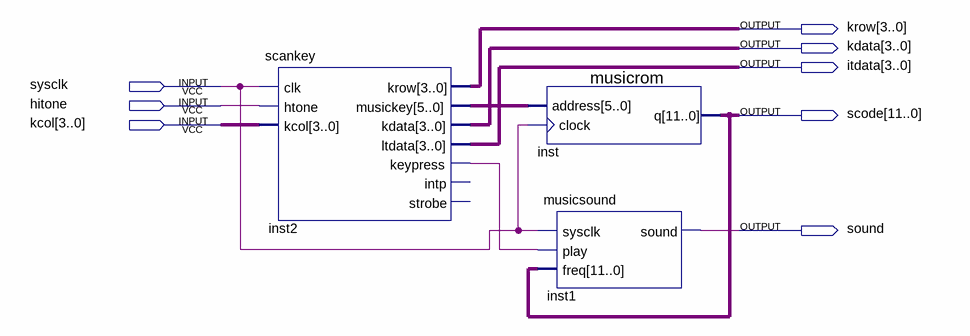
[diagram p0: schematic sheet]
// Quartus schematic muscikey.bdf as structural Verilog: 3 symbols, 8 pins
module muscikey (
  input  sysclk,
  input  hitone,
  input  [3:0] kcol,
  output [3:0] krow,
  output [3:0] kdata,
  output [3:0] itdata,
  output [11:0] scode,
  output sound
);

  wire inst2_keypress;
  wire [5:0] inst2_musickey;

  scankey inst2 (
    .clk(sysclk), .htone(hitone), .kcol(kcol), .krow(krow), .musickey(inst2_musickey), .kdata(kdata),
    .ltdata(itdata), .keypress(inst2_keypress));  // open: intp, strobe
  musicrom inst (.address(inst2_musickey), .clock(sysclk), .q(scode));
  musicsound inst1 (.sysclk(sysclk), .play(inst2_keypress), .freq(scode), .sound(sound));
endmodule
